# Altium schematic sheet MCU-IO.SchDoc: =ProjectDescription
size 297 x 209 mm; Address1: Address1; Address2: Address2; Address3: Address3; Address4: Address4; SheetNumber: 3; SheetTotal: 7; Scale: 1:1; DocumentType: Схема электрическая принципиальная
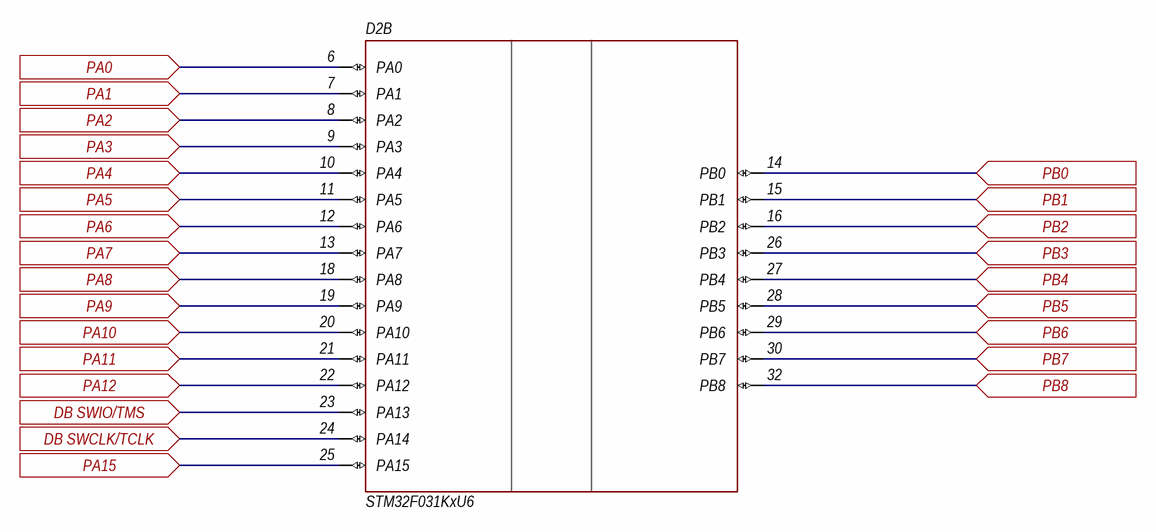
[diagram p0: MCU-IO.SchDoc]

## Parts
D2  STM32F031KxU6  [32-UFQFPN]  (part B of 2)

## Ports
DB SWCLK/TCLK (in), DB SWIO/TMS (in), PA0 (in), PA1 (in), PA2 (in), PA3 (in), PA4 (in), PA5 (in), PA6 (in), PA7 (in), PA8 (in), PA9 (in), PA10 (in), PA11 (in), PA12 (in), PA15 (in), PB0 (in), PB1 (in), PB2 (in), PB3 (in), PB4 (in), PB5 (in), PB6 (in), PB7 (in), PB8 (in)

## Nets
DB SWCLK/TCLK: D2.24(PA14) ; port DB SWCLK/TCLK
DB SWIO/TMS: D2.23(PA13) ; port DB SWIO/TMS
PA0: D2.6(PA0) ; port PA0
PA1: D2.7(PA1) ; port PA1
PA2: D2.8(PA2) ; port PA2
PA3: D2.9(PA3) ; port PA3
PA4: D2.10(PA4) ; port PA4
PA5: D2.11(PA5) ; port PA5
PA6: D2.12(PA6) ; port PA6
PA7: D2.13(PA7) ; port PA7
PA8: D2.18(PA8) ; port PA8
PA9: D2.19(PA9) ; port PA9
PA10: D2.20(PA10) ; port PA10
PA11: D2.21(PA11) ; port PA11
PA12: D2.22(PA12) ; port PA12
PA15: D2.25(PA15) ; port PA15
PB0: D2.14(PB0) ; port PB0
PB1: D2.15(PB1) ; port PB1
PB2: D2.16(PB2) ; port PB2
PB3: D2.26(PB3) ; port PB3
PB4: D2.27(PB4) ; port PB4
PB5: D2.28(PB5) ; port PB5
PB6: D2.29(PB6) ; port PB6
PB7: D2.30(PB7) ; port PB7
PB8: D2.32(PB8) ; port PB8

## Notes on the sheet
- Изм.
- Лист
- № докум.
- Подп.
- Дата
- Копировал
- Формат А4

## Library data of the parts
D2 = STM32F031KxU6: STM32, Cortex-M0; Manufacturer: ST Microelectronics; Model: STM32F031KxU6; ComponentKind: STM32, 2.0-3.6V, 32-UFQFPN; HelpURL: https://lcsc.com/product-detail/ST-Microelectronics_STMicroelectronics-STM32F031K6U6_C97412.html